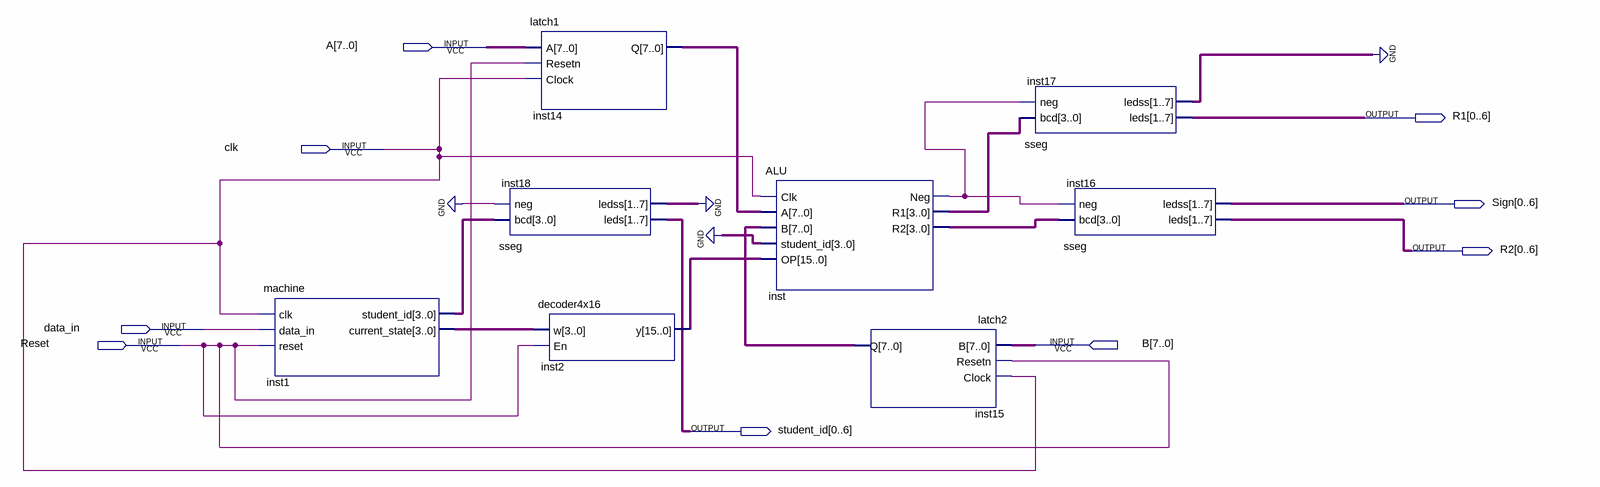
[diagram p0: schematic sheet]
// Quartus schematic blockdiagrambasics.bdf as structural Verilog: 8 symbols, 9 pins
module blockdiagrambasics (
  input  [7:0] A,
  input  clk,
  input  data_in,
  input  Reset,
  input  [7:0] B,
  output [0:6] R1,
  output [0:6] Sign,
  output [0:6] R2,
  output [0:6] student_id
);

  wire inst_neg;
  wire [3:0] inst1_current_state, inst1_student_id, inst_r1, inst_r2;
  wire [6:0] inst17_ledss, inst18_ledss;
  wire [7:0] inst14_q, inst15_q;
  wire [15:0] inst2_y;

  machine inst1 (
    .clk(clk), .data_in(data_in), .reset(Reset), .student_id(inst1_student_id),
    .current_state(inst1_current_state));
  latch1 inst14 (.A(A), .Resetn(Reset), .Clock(clk), .Q(inst14_q));
  sseg inst18 (.bcd(inst1_student_id), .neg(1'b0), .leds(student_id), .ledss(inst18_ledss));
  decoder4x16 inst2 (.w(inst1_current_state), .En(Reset), .y(inst2_y));
  ALU inst (
    .Clk(clk), .A(inst14_q), .B(inst15_q), .student_id(4'b0000), .OP(inst2_y), .Neg(inst_neg), .R1(inst_r1),
    .R2(inst_r2));
  latch2 inst15 (.B(B), .Resetn(Reset), .Clock(clk), .Q(inst15_q));
  sseg inst17 (.bcd(inst_r1), .neg(inst_neg), .leds(R1), .ledss(inst17_ledss));
  sseg inst16 (.bcd(inst_r2), .neg(inst_neg), .leds(R2), .ledss(Sign));
  // also tied to GND on the sheet: {inst18_ledss[0], inst18_ledss[1], inst18_ledss[2], inst18_ledss[3], inst18_ledss[4], inst18_ledss[5], inst18_ledss[6], inst17_ledss[0], inst17_ledss[1], inst17_ledss[2], inst17_ledss[3], inst17_ledss[4], inst17_ledss[5], inst17_ledss[6]}
endmodule
